# EAGLE design Moteino (EAGLE 6.5.0)
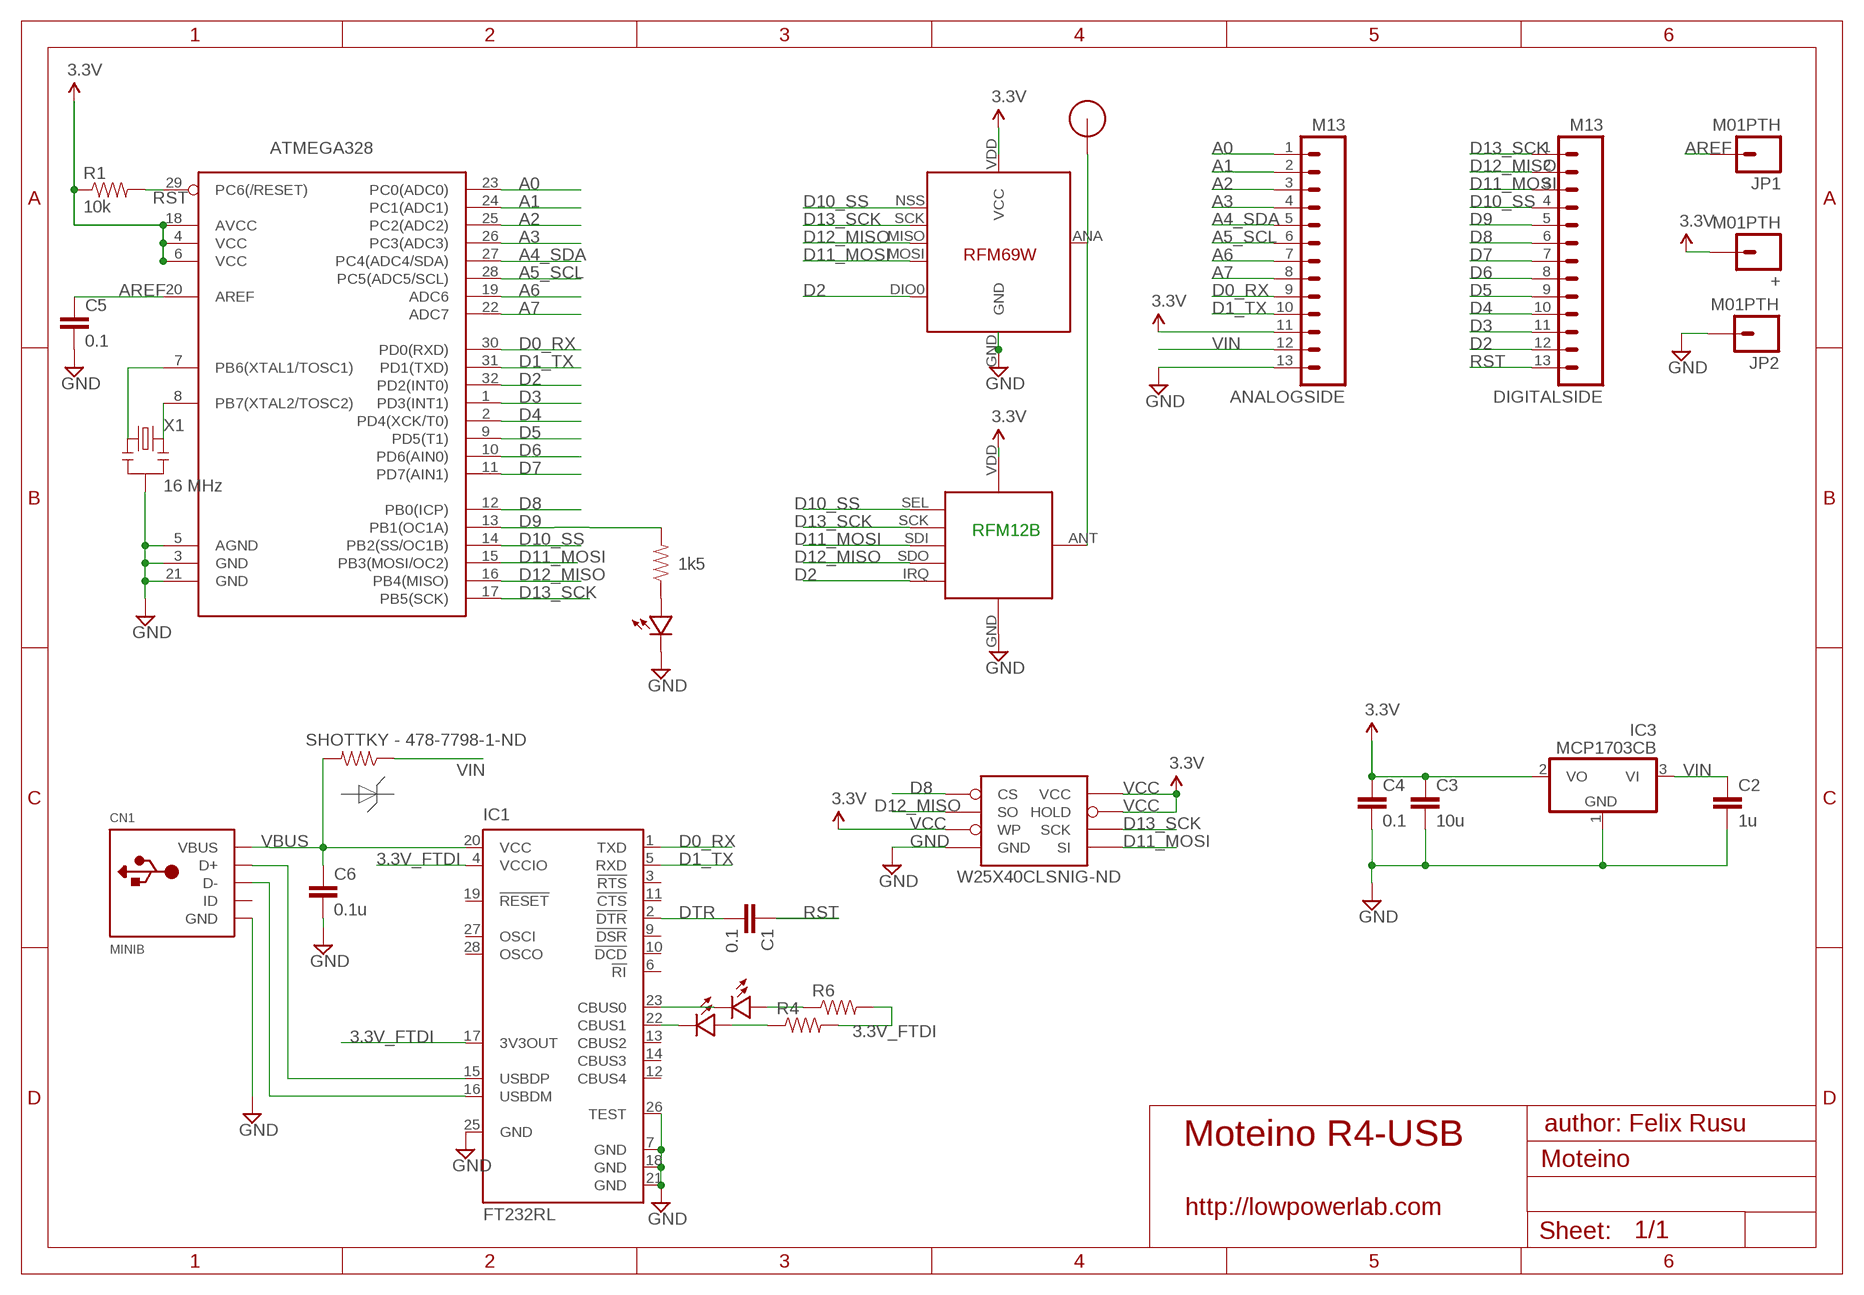
[diagram p0: schematic, sheet 1]

## Parts
+  M01PTH  [1X01]
ANALOGSIDE  M13  [1X13]
ATMEGA328  ATMega-328  ATMEGA168/328TQFP32  [TQFP32-08]
C1  0.1  CAP0603-CAP  [0603-CAP]
C2  1u  CAP0603-CAP  [0603-CAP]
C3  10u  CAP0805-CAP  [0805-CAP]
C4  0.1  CAP0603-CAP  [0603-CAP]
C5  0.1  CAP0603-CAP  [0603-CAP]
C6  0.1u  CAP0603-CAP  [0603-CAP]
CN1  MINIB  USBMINIB  [USB-MINIB]
D  SHOTTKY - 478-7798-1-ND  RESISTOR0603-RES  [0603-RES]
DIGITALSIDE  M13  [1X13]
IC1  FT232RL  [SSOP28]
IC3  MCP1703CB  [SOT23]
JP1  M01PTH  [1X01]
JP2  M01PTH  [1X01]
R1  10k  RESISTOR0603-RES  [0603-RES]
R2  1k5  RESISTOR0603-RES  [0603-RES]
R4  RESISTOR0603-RES  [0603-RES]
R6  RESISTOR0603-RES  [0603-RES]
RFM12B  RFM12B_MINPADS  [RFM12B-MINPADS]
U$1  RFM12B_ANTENNA  [RFM12B-ANTENNA]
U$2  LED0603  [0603-LED]
U$4  LED0603  [0603-LED]
U$5  RFM69  [RFM69W-MINPADS]
U$7  LED0603  [0603-LED]
W25X40CLSNIG-ND  AT25F512BWIDE_5.3MM  [SO08WIDE]
X1  16 MHz  RESONATORSMD  [RESONATOR-SMD]

## Nets
3.3V_FTDI: IC1.4(VCCIO) IC1.17(3V3OUT) R4.2 R6.2
A0: ANALOGSIDE.1 ATMEGA328.23(PC0(ADC0))
A1: ANALOGSIDE.2 ATMEGA328.24(PC1(ADC1))
A2: ANALOGSIDE.3 ATMEGA328.25(PC2(ADC2))
A3: ANALOGSIDE.4 ATMEGA328.26(PC3(ADC3))
A4_SDA: ANALOGSIDE.5 ATMEGA328.27(PC4(ADC4/SDA))
A5_SCL: ANALOGSIDE.6 ATMEGA328.28(PC5(ADC5/SCL))
A6: ANALOGSIDE.7 ATMEGA328.19(ADC6)
A7: ANALOGSIDE.8 ATMEGA328.22(ADC7)
AREF: ATMEGA328.20(AREF) C5.1 JP1.1
D0_RX: ANALOGSIDE.9 ATMEGA328.30(PD0(RXD)) IC1.1(TXD)
D1_TX: ANALOGSIDE.10 ATMEGA328.31(PD1(TXD)) IC1.5(RXD)
D2: ATMEGA328.32(PD2(INT0)) DIGITALSIDE.12 RFM12B.IRQ U$5.DIO0
D3: ATMEGA328.1(PD3(INT1)) DIGITALSIDE.11
D4: ATMEGA328.2(PD4(XCK/T0)) DIGITALSIDE.10
D5: ATMEGA328.9(PD5(T1)) DIGITALSIDE.9
D6: ATMEGA328.10(PD6(AIN0)) DIGITALSIDE.8
D7: ATMEGA328.11(PD7(AIN1)) DIGITALSIDE.7
D8: ATMEGA328.12(PB0(ICP)) DIGITALSIDE.6 W25X40CLSNIG-ND.1(CS)
D9: ATMEGA328.13(PB1(OC1A)) DIGITALSIDE.5 R2.2
D10_SS: ATMEGA328.14(PB2(SS/OC1B)) DIGITALSIDE.4 RFM12B.SEL U$5.NSS(SEL)
D11_MOSI: ATMEGA328.15(PB3(MOSI/OC2)) DIGITALSIDE.3 RFM12B.SDI(SDI/MOSI) U$5.MOSI W25X40CLSNIG-ND.5(SI)
D12_MISO: ATMEGA328.16(PB4(MISO)) DIGITALSIDE.2 RFM12B.SDO(SDO/MISO) U$5.MISO W25X40CLSNIG-ND.2(SO)
D13_SCK: ATMEGA328.17(PB5(SCK)) DIGITALSIDE.1 RFM12B.SCK U$5.SCK W25X40CLSNIG-ND.6(SCK)
DTR: C1.2 IC1.2(!DTR)
GND [power]: ANALOGSIDE.13 ATMEGA328.3(GND) ATMEGA328.5(AGND) ATMEGA328.21(GND) C2.2 C3.2 C4.2 C5.2 C6.2 CN1.GND IC1.7(GND) IC1.18(GND) IC1.21(GND) IC1.25(GND) IC1.26(TEST) IC3.1(GND) JP2.1 RFM12B.GND U$2.MINUS U$5.GND W25X40CLSNIG-ND.4(GND) X1.2
N$1: ATMEGA328.7(PB6(XTAL1/TOSC1)) X1.1
N$2: R2.1 U$2.PLUS
N$3: RFM12B.ANT U$1.P$1 U$5.ANA(ANT)
N$4: CN1.D+ IC1.15(USBDP)
N$5: CN1.D- IC1.16(USBDM)
N$6: IC1.23(CBUS0) U$4.MINUS
N$7: IC1.22(CBUS1) U$7.MINUS
N$8: R4.1 U$7.PLUS
N$9: R6.1 U$4.PLUS
N$21: ATMEGA328.8(PB7(XTAL2/TOSC2)) X1.3
RST: ATMEGA328.29(PC6(/RESET)) C1.1 DIGITALSIDE.13 R1.2
VBUS [power]: C6.1 CN1.VBUS D.2 IC1.20(VCC)
VCC: +.1 ANALOGSIDE.11 ATMEGA328.4(VCC) ATMEGA328.6(VCC) ATMEGA328.18(AVCC) C3.1 C4.1 IC3.2(VO) R1.1 RFM12B.VDD U$5.VDD(VCC) W25X40CLSNIG-ND.3(WP) W25X40CLSNIG-ND.7(HOLD) W25X40CLSNIG-ND.8(VCC) ; supply symbol labelled 3.3V
VIN: ANALOGSIDE.12 C2.1 D.1 IC3.3(VI)
Unconnected: CN1.ID IC1.3(!RTS) IC1.6(!RI) IC1.9(!DSR) IC1.10(!DCD) IC1.11(!CTS) IC1.12(CBUS4) IC1.13(CBUS2) IC1.14(CBUS3) IC1.19(!RESET) IC1.27(OSCI) IC1.28(OSCO)

## Notes on the sheet
- RFM12B
- author: Felix Rusu
- Moteino R4-USB
- http://lowpowerlab.com

## Library data of the parts
+ JP1 JP2 = SparkFun-Connectors:M01: Header 1 Standard 1-pin 0.1" header. Use with straight break away headers (SKU : PRT-00116), right angle break away headers (PRT-00553), swiss pins (PRT-00743), machine pins (PRT-00117), and female headers (PRT-00115).
ANALOGSIDE DIGITALSIDE = SparkFun-Connectors:M13: 13-pin single row .1" header
ATMEGA328 = LowPowerLab:ATMEGA168/328: Atmel 32-pin 8-bit micro, 16k flash.
C1-C6 = LowPowerLab:CAP: Capacitor Standard 0603 ceramic capacitor, and 0.1" leaded capacitor.
CN1 = LowPowerLab:USB: USB Connectors USBMINIB - Surface Mount Female Mini-B USB Connector 4UConnector: 06564 By microbuilder.eu Thru-hole RA Female Mini-B USB Connector 4UConnector: 18732 By ladyada.net
D R1 R2 R4 R6 = LowPowerLab:RESISTOR: Resistor Basic schematic elements and footprints for 0603, 1206, and PTH resistors.
IC1 = ftdichip:FT232R: Source: http://www.ftdichip.com/Documents/DataSheets/DS_FT232R_v104.pdf
IC3 = linear:MCP1703: 250 mA, 16V, Low Quiescent Current LDO Regulator Source: http://ww1.microchip.com/downloads/en/DeviceDoc/22049b.pdf
RFM12B = LowPowerLab:RFM12B_MINPADS
U$1 = LowPowerLab:RFM12B_ANTENNA
U$2 U$4 U$7 = LowPowerLab:LED
U$5 = LowPowerLab:RFM69
W25X40CLSNIG-ND = LowPowerLab:AT25F512B: 4-Mbit SPI flash memory
X1 = SparkFun:RESONATOR: Resonator Small SMD resonator. This is the itty bitty 10/20MHz resonators with built in caps. CSTCE10M0G55 and CSTCE20M0V53. Footprint has been reviewed closely but hasn't been tested yet.

## Net classes
1 power: width 0.381 mm, clearance 0.254 mm

## Board
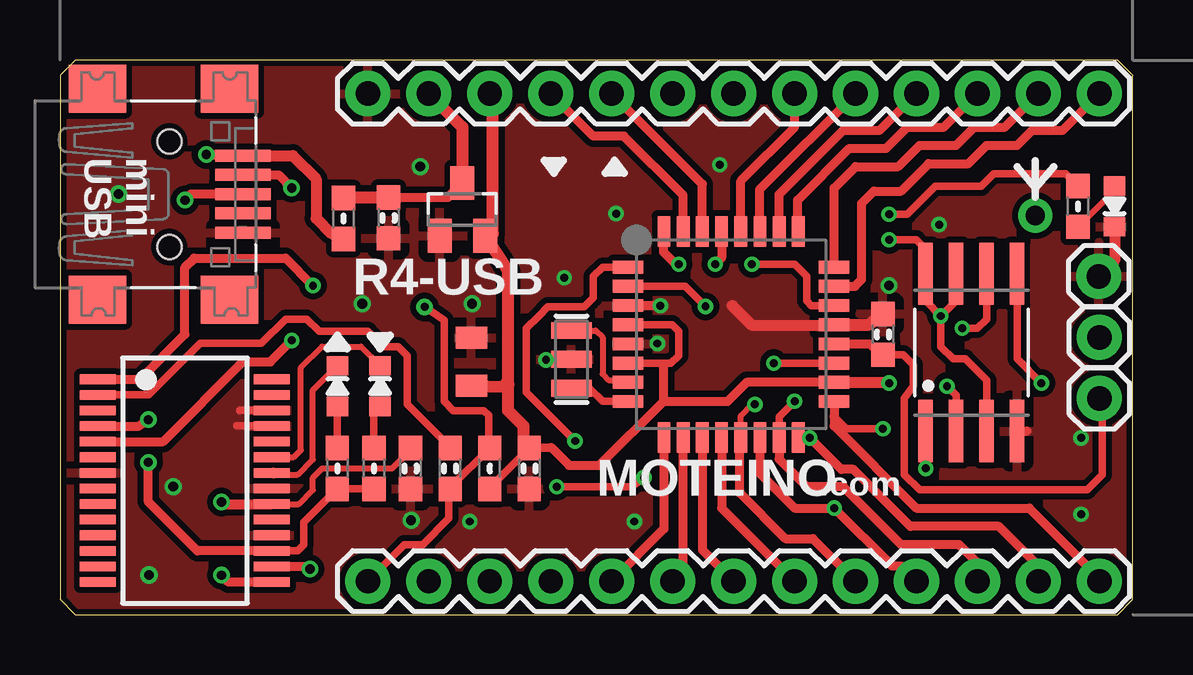
[diagram p1: board, top side]
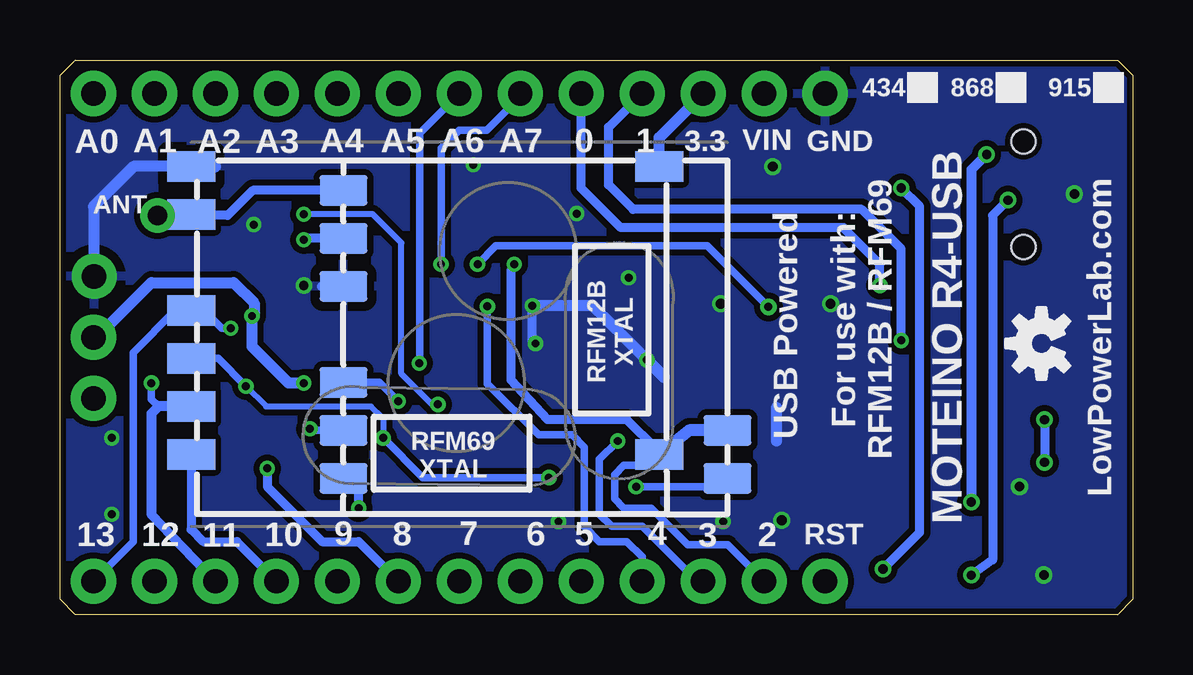
[diagram p2: board, bottom side, seen from below]

Size 44.7 x 23.11 mm. Coordinates in mm from the lower left corner, seen from the top.
Outline: 0.63,0 44.07,0 44.7,0.64 44.7,22.48 44.07,23.11 0.63,23.11 0,22.48 0,0.64 0.63,0
Copper layers (1*16): Top 0.035mm / dielectric 1.5mm / Bottom 0.035mm
Design rules "ITEADstudio_DRC *": minimum track width 6mil, minimum drill 12mil, track to track 6mil, track to pad 6mil, pad to pad 6mil, via to via 6mil, smd to smd 0mil, copper to edge 10mil, drill to drill 10mil, minimum pad ring 10mil, minimum via ring 6mil, stop-mask expansion 2mil, vias tented up to drill 100mil, thermal gap 15mil
tRestrict: area 7.1,15.2 to 8,15.7; area 8.4,8 to 9.3,8.5
bRestrict: area 38.7,17.5 to 39.6,18; area 38.7,19.1 to 39.6,19.6; area 31.6,13.3 to 32.1,14.2; area 32.1,12.7 to 32.6,13.6; area 33,12.7 to 33.5,13.6

### Footprints (pad centres in the part's own frame; a part is rotated, then mirrored left to right if it is on the bottom)
1X01 = drill 1.016 pad 1.88: 1 0,0
1X13 = drill 1.016 pad 1.88: 1 0,0; 2 2.54,0; 3 5.08,0; 4 7.62,0; 5 10.16,0; 6 12.7,0; 7 15.24,0; 8 17.78,0; 9 20.32,0; 10 22.86,0; 11 25.4,0; 12 27.94,0; 13 30.48,0
TQFP32-08 = smd 1.27 x 0.533: 1 -4.293,2.8; 2 -4.293,2; 3 -4.293,1.2; 4 -4.293,0.4; 5 -4.293,-0.4; 6 -4.293,-1.2; 7 -4.293,-2; 8 -4.293,-2.8; 17 4.293,-2.8; 18 4.293,-2; 19 4.293,-1.2; 20 4.293,-0.4; 21 4.293,0.4; 22 4.293,1.2; 23 4.293,2; 24 4.293,2.8 | smd 0.533 x 1.27: 9 -2.8,-4.293; 10 -2,-4.293; 11 -1.2,-4.293; 12 -0.4,-4.293; 13 0.4,-4.293; 14 1.2,-4.293; 15 2,-4.293; 16 2.8,-4.293; 25 2.8,4.293; 26 2,4.293; 27 1.2,4.293; 28 0.4,4.293; 29 -0.4,4.293; 30 -1.2,4.293; 31 -2,4.293; 32 -2.8,4.293
0603-CAP = smd 1.016 x 0.965: 1 -0.85,0; 2 0.85,0
0805-CAP = smd 0.902 x 1.3: 1 -1,0; 2 1,0
USB-MINIB = smd 0.5 x 2.308: D+ 0,4.064; D- -0.8,4.064; GND 1.6,4.064; ID 0.8,4.064; VBUS -1.6,4.064 | smd 2 x 2.4: GND1 -4.4,-2; GND2 -4.4,3.5; GND3 4.4,3.5; GND4 4.4,-2 | hole 1: -2.2,1; 2.2,1
0603-RES = smd 1.016 x 0.965: 1 -0.85,0; 2 0.85,0
SSOP28 = smd 0.4 x 1.5: 1 -4.225,-3.625; 2 -3.575,-3.625; 3 -2.925,-3.625; 4 -2.275,-3.625; 5 -1.625,-3.625; 6 -0.975,-3.625; 7 -0.325,-3.625; 8 0.325,-3.625; 9 0.975,-3.625; 10 1.625,-3.625; 11 2.275,-3.625; 12 2.925,-3.625; 13 3.575,-3.625; 14 4.225,-3.625; 15 4.225,3.625; 16 3.575,3.625; 17 2.925,3.625; 18 2.275,3.625; 19 1.625,3.625; 20 0.975,3.625; 21 0.325,3.625; 22 -0.325,3.625; 23 -0.975,3.625; 24 -1.625,3.625; 25 -2.275,3.625; 26 -2.925,3.625; 27 -3.575,3.625; 28 -4.225,3.625
SOT23 = smd 1 x 1.4: 1 -0.95,-1.1; 2 0.95,-1.1; 3 0,1.1
RFM12B-MINPADS = smd 2 x 1.27: ANT 8,-6; GND 8,-2; IRQ -8,4; SCK 8,4; SDI 8,2; SDO -8,6; SEL 8,6; VDD 8,-4
RFM12B-ANTENNA = drill 0.8 pad 1.422: P$1 0,0
0603-LED = smd 0.8 x 0.9: MINUS -0.85,0; PLUS 0.85,0
RFM69W-MINPADS = smd 2 x 1.27: ANA 8,-5; DIO0 -11.5,5; GND 8,-7; MISO 8,1; MOSI 8,3; NSS 8,5; SCK 8,-1; VDD -11.5,-7
SO08WIDE = smd 0.61 x 2.6: 1 -1.905,-3.269; 2 -0.635,-3.269; 3 0.635,-3.269; 4 1.905,-3.269; 5 1.905,3.286; 6 0.635,3.286; 7 -0.635,3.286; 8 -1.905,3.286
RESONATOR-SMD = smd 0.7 x 1.7: 1 -1.2,0; 2 0,0; 3 1.2,0

### Placement (x,y rotation side)
+  43.31,11.56 270 top
ANALOGSIDE  43.31,21.72 180 top
ATMEGA328  27.97,11.68 0 top
C1  16.26,6.1 90 top
C2  13.69,16.54 270 top
C3  17.15,10.54 90 top
C4  19.56,6.1 270 top
C5  34.29,11.68 90 top
C6  14.6,6.1 270 top
CN1  3.56,17.53 270 top
D  11.81,16.51 270 top
DIGITALSIDE  43.31,1.4 180 top
IC1  5.21,5.59 270 top
IC3  16.76,16.89 0 top
JP1  43.31,9.02 0 top
JP2  43.28,14.1 0 top
R1  17.91,6.1 90 top
R2  42.42,17.02 90 top
R4  11.56,6.1 270 top
R6  13.08,6.1 270 top
RFM12B  24.89,11.68 180 bottom
U$1  40.64,16.64 0 top
U$2  43.94,17.02 90 top
U$3  [OSHW-LOGO-S]  3.81,11.3 90 bottom
U$4  13.33,9.53 270 top
U$5  31.24,11.68 180 bottom
U$7  11.56,9.53 270 top
W25X40CLSNIG-ND  37.97,10.92 0 top
X1  21.31,10.64 270 top

### Tracks (layer width: path | path; a pad name or v marks a point on that pad's centre or on a via)
3.3V_FTDI  (via drill 0.38)
  Top 0.305: IC1.17 9.91,2.67 10.16,2.92 10.16,3.85 R4.2 R6.2
  Top 0.381: IC1.4 3.29,7.86 v3.68,8.13 | IC1.17 5.72,2.66 3.68,4.7 v3.68,6.35
  Bottom 0.381: v3.68,8.13 v3.68,6.35
A0
  Top 0.381: ATMEGA328.23 33.11,13.68 33.4,13.97 33.4,17.14 33.91,17.65 35.05,17.65 36.2,18.8 37.85,18.8 38.61,19.56 39.88,19.56 40.51,20.19 41.78,20.19 ANALOGSIDE.1
A1
  Top 0.381: ATMEGA328.24 32.26,17.78 33.15,18.67 34.92,18.67 35.81,19.56 37.34,19.56 38.1,20.32 39.37,20.32 ANALOGSIDE.2
A2
  Top 0.381: ATMEGA328.25 30.73,15.98 30.73,17.27 32.89,19.43 34.42,19.43 35.31,20.32 36.83,20.32 ANALOGSIDE.3
A3
  Top 0.381: ATMEGA328.26 29.96,17.52 32.64,20.19 34.16,20.19 ANALOGSIDE.4
A4_SDA
  Top 0.381: ATMEGA328.27 29.16,17.73 ANALOGSIDE.5
A5_SCL
  Top 0.381: ATMEGA328.28 28.36,18.08 30.61,20.32 ANALOGSIDE.6
A6  (via drill 0.33)
  Top 0.305: ATMEGA328.19 v29.74,10.48
  Bottom 0.305: 29.72,10.41 29.72,20.07 ANALOGSIDE.7
  Bottom 0.381: 29.72,10.41 v29.74,10.48
A7  (via drill 0.33)
  Top 0.305: ATMEGA328.22 31.31,12.88 31.11,13.08 31.11,14.1 30.61,14.61 v28.83,14.61
  Bottom 0.305: v28.83,14.61 28.83,19.43 28.07,20.19 26.92,20.19 25.53,21.59 ANALOGSIDE.8
AREF
  Top 0.305: C5.1 35.14,10.83 35.56,10.41 35.56,9.53 35.18,9.02 35.18,5.84 35.81,5.21 42.8,5.21 43.43,5.84 43.43,8.89 JP1.1
  Top 0.381: ATMEGA328.20 33.71,11.28 C5.1
D0_RX  (via drill 0.33)
  Top 0.381: ATMEGA328.30 26.77,17.94 ANALOGSIDE.9 | v10.54,13.72 9.4,14.86 5.59,14.86 5.21,14.48 5.21,11.68 3.34,9.81 IC1.1
  Bottom 0.381: 23.11,21.59 ANALOGSIDE.9 22.99,17.78 21.34,16.13 13.84,16.13 12.06,16.13 10.54,14.61 v10.54,13.72
D1_TX  (via drill 0.33)
  Top 0.381: ATMEGA328.31 25.96,17.47 23.49,19.94 22.22,19.94 ANALOGSIDE.10 | IC1.5 4.29,7.21 7.62,10.54 8.76,10.54 v9.65,11.43
  Bottom 0.381: v9.65,11.43 9.65,15.24 11.3,16.89 20.83,16.89 21.84,17.91 21.84,20.32 ANALOGSIDE.10
D2  (via drill 0.33)
  Top 0.381: v25.78,14.61 25.65,14.61 25.15,15.11 25.15,15.83 ATMEGA328.32
  Bottom 0.305: DIGITALSIDE.12 16.89,2.92 18.54,2.92 20.07,4.45 21.21,4.45 21.59,4.83 21.59,5.84 21.21,6.22 20.2,6.22 U$5.DIO0
  Bottom 0.381: 19.28,6.89 19.84,6.89 21.08,8.13 24.38,8.13 25.91,9.78 25.91,14.35 v25.78,14.61
  Bottom 0.406: U$5.DIO0 19.48,6.68 19.28,6.89
  Bottom 0.508: RFM12B.IRQ 18.49,7.68 U$5.DIO0
D3  (via drill 0.33)
  Top 0.305: v21.46,7.24 19.43,9.27 19.43,11.05 19.43,11.94 19.94,12.45 20.32,12.83 21.84,12.83 22.22,13.21 22.22,14.1 22.61,14.48 ATMEGA328.1
  Top 0.381: ATMEGA328.1
  Bottom 0.305: DIGITALSIDE.11 18.16,1.4 20.45,3.68 21.72,3.68 22.22,4.19 22.22,6.48 v21.46,7.24
D4  (via drill 0.33)
  Top 0.305: ATMEGA328.2 26.06,13.68 v26.89,12.85
  Top 0.381: 23.6,13.73 ATMEGA328.2
  Bottom 0.305: DIGITALSIDE.10 20.45,2.41 21.08,3.05 22.22,3.05 22.86,3.68 22.86,6.99 23.37,7.49 24.77,7.49 26.89,9.62 v26.89,12.85
D5
  Top 0.381: ATMEGA328.9 25.16,3.58 DIGITALSIDE.9
D6
  Top 0.381: DIGITALSIDE.8 25.96,1.83 ATMEGA328.10
D7
  Top 0.381: ATMEGA328.11 26.77,2.7 DIGITALSIDE.7
D8  (via drill 0.33)
  Top 0.305: v36.07,6.1 36.05,7.75 W25X40CLSNIG-ND.1
  Top 0.381: ATMEGA328.12 27.56,4.44 DIGITALSIDE.6
  Bottom 0.381: v36.07,6.1 36.07,5.33 33.78,3.05 32.26,3.05 DIGITALSIDE.6
D9  (via drill 0.33)
  Top 0.254: ATMEGA328.13 28.36,8.3 28.83,8.76 v28.96,8.76
  Top 0.305: R2.2 41.91,18.38 38.9,18.38 38.38,17.86 36.47,17.86 35.31,16.69 v34.54,16.69
  Top 0.381: ATMEGA328.13 28.32,7.31 28.32,5.08 30.23,3.17 31.37,3.17 DIGITALSIDE.5
  Bottom 0.254: v28.96,8.76 29.21,8.76 30.48,10.03 30.48,15.49 31.67,16.69 v34.54,16.69
D10_SS  (via drill 0.33)
  Top 0.381: ATMEGA328.14 29.16,5.89 30.61,4.45 v32.26,4.45 34.67,2.03 35.05,2.03 DIGITALSIDE.4
  Bottom 0.254: 32.26,5.43 RFM12B.SEL
  Bottom 0.381: v32.26,4.45 32.26,5.43 | U$5.NSS 39.24,3.56 38.73,3.05 37.34,3.05 DIGITALSIDE.4
D11_MOSI  (via drill 0.33)
  Top 0.305: v40.89,9.65 39.88,10.67 W25X40CLSNIG-ND.5 | ATMEGA328.15 29.96,8.25 v30.61,8.89
  Top 0.381: ATMEGA328.15 29.96,6.48 31.11,5.33 32.64,5.33 35.05,2.92 37.46,2.92 38.23,2.16 DIGITALSIDE.3
  Bottom 0.305: v40.89,9.65 40.89,8.99 40.59,8.68 | v30.61,8.89 31.4,9.68 RFM12B.SDI
  Bottom 0.381: DIGITALSIDE.3 40.89,4.19
  Bottom 0.406: U$5.MOSI 40.59,8.68 40.89,8.38 40.89,4.19
D12_MISO  (via drill 0.33)
  Top 0.305: v36.96,9.53 37.34,9.14 37.34,8.51 W25X40CLSNIG-ND.2 | v20.7,5.33 23.82,5.33 v24.33,5.71
  Top 0.381: ATMEGA328.16 31.34,7.39 v31.24,7.37 32.55,6.06 33.06,6.06 35.43,3.68 39.12,3.68 40.77,2.03 DIGITALSIDE.2
  Bottom 0.254: v36.96,9.53 36.12,8.69 31.75,8.69 31.24,8.18 v31.24,7.37
  Bottom 0.305: U$5.MISO 38.12,10.68 v36.96,9.53 37.27,9.84 | v31.24,7.37 29.59,5.71 v24.33,5.71 | v20.7,5.33 17.24,5.33 RFM12B.SDO
D13_SCK  (via drill 0.33)
  Top 0.305: v37.59,11.94 38.23,11.94 38.61,12.32 W25X40CLSNIG-ND.6 | v34.29,7.75 32.77,7.75 32.26,8.26
  Top 0.381: DIGITALSIDE.1 43.31,1.52 40.39,4.45 35.68,4.45 32.26,7.87 32.26,8.26 ATMEGA328.17
  Bottom 0.305: RFM12B.SCK 34.23,7.68 v34.29,7.75 | DIGITALSIDE.1 41.66,3.05 41.66,10.92 39.89,12.68 U$5.SCK 39.23,12.7 38.73,12.7 37.97,11.94 v37.59,11.94
DTR
  Top 0.305: IC1.2 3.7,9.16 5.84,11.3 8.38,11.3 9.4,12.32 10.29,12.32 10.79,11.81 12.83,11.81 13.46,11.18 14.1,11.18 14.48,10.79 14.48,8.76 16.26,6.99 16.19,6.99 | 16.19,6.99 C1.2 16.19,6.99
  Top 0.381: 16.19,6.99 C1.2
GND  (via drill 0.33, 0.38, 0.41)
  Top 0.305: 8.89,8.51 8.76,8.51 | 8.76,8.51 8.89,8.51 | 8.89,8.51 9.14,8.51 8.89,8.51 | 8.89,8.51 8.76,8.51 | 8.76,7.87 8.83,7.87 | 8.83,7.87 9.4,7.87 8.83,7.87 | 8.83,7.87 8.76,7.87 | 8.76,7.87 8.83,7.87 | 8.83,7.87 IC1.25 | 8.89,8.51 IC1.26 7.49,8.51 | 8.83,7.87 7.37,7.87
  Top 0.381: 32.37,12.06 ATMEGA328.21 | v25.02,12.88 ATMEGA328.3 | 27.96,12.88 28.02,12.88 | W25X40CLSNIG-ND.4 40.29,7.65 | v20.25,10.62 X1.2
  Top 0.457: 32.37,12.06 28.83,12.06 28.02,12.88 | JP2.1 43.94,14.76 U$2.MINUS
  Top 0.508: ATMEGA328.21 33.71,12.08 C5.2 34.42,12.41
  Bottom 0.381: 25.02,12.81 v25.02,12.88 25.02,11.3 v24.89,11.3 | RFM12B.GND 33.81,13.68
  Bottom 0.457: 43.31,14.12 JP2.1 43.31,14.12 | 38.24,18.68 41.64,18.68 43.31,17.02 43.31,14.12 | v20.25,10.62 22.51,12.88 v25.02,12.88 | 14.86,8.64 14.86,7.24
  Bottom 0.508: U$5.GND 38.24,18.68 | 19.54,9.91 v20.25,10.62
  other vias: 34.54,13.72 17.08,3.89 23.93,3.89 21.01,14.05 23.17,16.71 27.49,18.75 36.63,16.26 42.54,7.37 42.54,4.19 3.71,1.66 4.72,5.34 2.44,17.53 15.01,18.67 14.63,3.94 12.6,12.96 17.17,12.96
  pour Bottom: -0.51,24 -0.51,-0.76 45.47,-0.76 45.47,24
  pour Top: -0.51,24 -0.51,-0.76 45.47,-0.76 45.47,24
N$1
  Top 0.254: X1.1 22.32,11.84 22.61,11.56 22.61,10.03 22.86,9.78 23.58,9.78 ATMEGA328.7
N$2
  Top 0.254: R2.1 43.81,17.57 U$2.PLUS
N$3
  Bottom 0.381: U$1.P$1 39.92,16.68 U$5.ANA 38.94,16.64 37.72,16.64 36.67,17.68 RFM12B.ANT
N$4  (via drill 0.38)
  Top 0.381: IC1.15 7.02,1.36 v6.73,1.65 | CN1.D+ 5.46,17.53 v5.21,17.27
  Bottom 0.381: v6.73,1.65 5.84,2.29 5.84,16.64 v5.21,17.27
N$5  (via drill 0.38)
  Top 0.381: IC1.16 10.18,2.01 10.41,1.78 v10.41,1.91 | CN1.D- 9.11,18.33 v9.65,17.78
  Bottom 0.381: v10.41,1.91 8.89,3.43 8.89,17.02 v9.65,17.78
N$6
  Top 0.254: IC1.23 9.74,6.56 10.03,6.86 10.03,10.29 10.92,11.18 12.53,11.18 U$4.MINUS
N$7
  Top 0.254: 8.9,5.84 9.91,5.84 10.54,6.48 10.54,9.36 U$7.MINUS
  Top 0.305: 8.89,5.97 IC1.22 8.9,5.84
N$8
  Top 0.305: R4.1 U$7.PLUS
N$9
  Top 0.305: R6.1 13.08,8.29 U$4.PLUS
N$21
  Top 0.254: ATMEGA328.8
  Top 0.305: X1.3 22.05,9.44 22.61,8.89 ATMEGA328.8
RST  (via drill 0.33, 0.33 pad 0.69)
  Top 0.305: v15.19,12.83 16,12.27 16,8.89 16.38,8.51 17.65,8.51 17.86,8.31 17.86,7 R1.2 16.31,5.35 16.2,5.35 C1.1 16.2,5.2 16.2,4.01 15.11,2.92 14.35,2.92 DIGITALSIDE.13
  Top 0.381: ATMEGA328.29 27.56,14.87 v27.3,14.61
  Bottom 0.305: v27.3,14.61 26.54,15.37 17.73,15.37 v15.19,12.83
VBUS  (via drill 0.38)
  Top 0.254: C6.1 14.22,6.48 13.84,6.1 10.92,6.1 10.54,5.71 10.54,5.21 9.95,4.61 IC1.20
  Top 0.305: 8.87,4.57 IC1.20 8.87,4.57
  Top 0.406: v6.73,4.7 6.82,4.61 IC1.20 | CN1.VBUS 6.78,19.13 v6.1,19.18
  Top 0.457: CN1.VBUS 9.7,19.13 10.67,18.16 10.67,16.51 11.3,15.88 11.6,15.88 D.2
  Bottom 0.406: v6.73,4.7 6.73,18.54 v6.1,19.18
VCC  (via drill 0.33)
  Top 0.305: ATMEGA328.4 25.51,12.08 25.78,11.81 25.78,10.79 25.46,10.48 25.27,10.48 | ATMEGA328.6 25.27,10.48 | v36.7,12.45 36.07,13.08 W25X40CLSNIG-ND.8 | v36.7,12.45 37.34,13.08 W25X40CLSNIG-ND.7 | v36.7,12.45 36.7,11.18 37.21,10.67 37.72,10.67 38.61,9.78 W25X40CLSNIG-ND.3 | v34.54,15.62 35.67,15.62 36.07,15.22 | 25.15,10.36 25.27,10.48 | R1.1 17.86,5.32 17.93,5.32 C4.1
  Top 0.381: 36.07,15.22 W25X40CLSNIG-ND.8 | ATMEGA328.18 28.61,9.68 27.81,8.89 25.15,8.89 | 25.15,8.89 25.15,10.36 | C4.1 20.46,6.97 21.21,6.22 22.48,6.22 25.15,8.89
  Top 0.457: ATMEGA328.18 34.64,9.68 v34.54,9.65
  Top 0.508: 19.3,7.07 C4.1 19.3,7.07 | C3.1 18.56,9.51 18.65,9.76 18.67,9.53 | 19.3,7.07 19.3,7.87 18.67,8.51 18.67,9.53 | 18.67,9.53 18.67,12.57 18.67,14.33 IC3.2 17.71,15.43 18.03,15.88 18.03,21.34 ANALOGSIDE.11
  Bottom 0.381: RFM12B.VDD 34.61,15.68 v34.54,15.62
  Bottom 0.457: +.1 43.18,11.56 40.89,13.84 37.46,13.84 36.61,12.99 36.61,12.54 v36.7,12.45 36.7,11.18 35.18,9.65 v34.54,9.65 | U$5.VDD 19.74,19.88 ANALOGSIDE.11
VIN
  Top 0.381: C2.1 16.16,17.39 IC3.3
  Top 0.508: 13.98,17.27 C2.1 11.84,17.39 D.1 | ANALOGSIDE.12 16.76,20.32 IC3.3

### Text on the board
tPlace: mini / USB | R4-USB | MOTEINO | .com
bPlace: LowPowerLab.com | MOTEINO R4-USB | For use with: / RFM12B / RFM69 | USB Powered | RFM12B / XTAL | RFM69 / XTAL
tDocu: REG
_tsilk: GND | VIN | 3.3 | 1 | 0 | A7 | A6 | A5 | A4 | A3 | A2 | A1 | A0 | SCL | SDA | TX | RX | ANT | GND | 3.3 | TX | RX | FLASH | ATMEGA / 328 | MEM | AR | ~ | 2 | 3 | ~ | 4 | 5 | ~ | ~ | 6 | 7 | 8 | 9 | ~ | ~ | 10 | MO | 11 | MI | 12 | SK | 13 | RST
_bsilk: 915 | 868 | 434 | VIN | 3.3 | 1 | 0 | A7 | A6 | A5 | A4 | A3 | A2 | A1 | A0 | GND | ANT | 2 | 3 | 4 | 5 | 6 | 7 | 8 | 9 | 10 | 11 | 12 | 13 | RST